# Altium schematic sheet hv_top.SchDoc: AcroIQ HV LED: Top Level
size A4; Author: Yann Ramin; DocumentNumber: 1; Revision: C; SheetNumber: 1; SheetTotal: 4
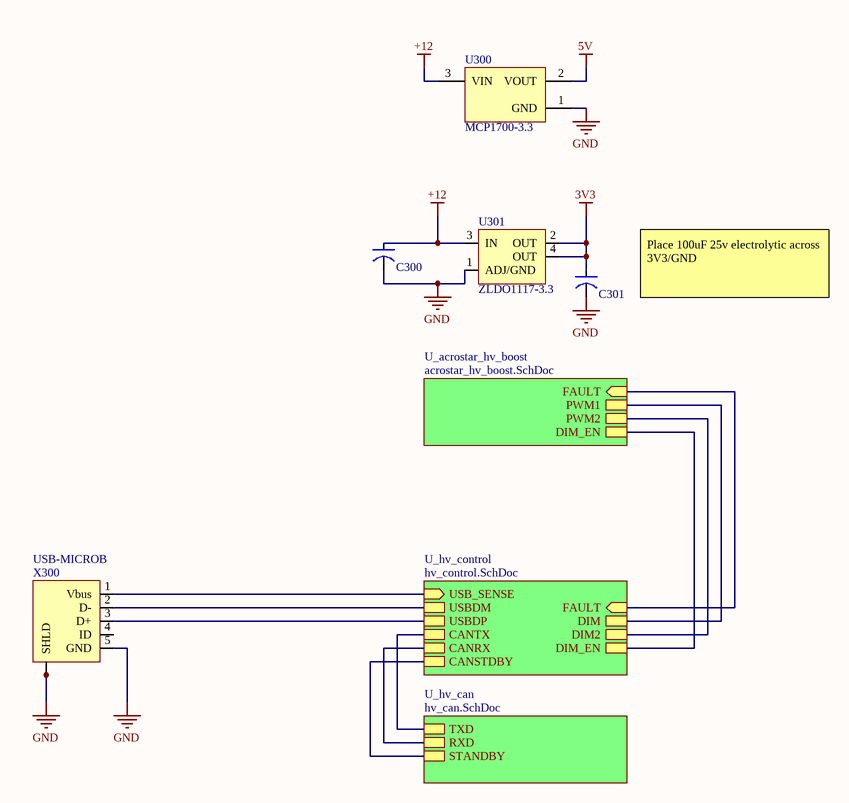
[diagram p0: hv_top.SchDoc]

## Parts
C300  CAP 4.7uF 25V TANT 2312  [CAPMP6032X28M]  (value not drawn)
C301  CAP 4.7uF 25V TANT 2312  [CAPMP6032X28M]  (value not drawn)
U300  MCP1700-3.3  [SOT-23-TT3_N]
U301  ZLDO1117-3.3  [SOT223]
X300  USB-MICROB  [FCI-10118193-0001LF]

## Sub-sheets
U_acrostar_hv_boost = acrostar_hv_boost.SchDoc: DIM_EN, FAULT (in), PWM2, PWM1
U_hv_can = hv_can.SchDoc: TXD, RXD, STANDBY
U_hv_control = hv_control.SchDoc: USB_SENSE (in), USBDM, USBDP, CANTX, CANRX, CANSTDBY, DIM, DIM2, DIM_EN, FAULT (in)

## Nets
3V3: C301.1 U301.2(OUT) U301.4(OUT)
5V: U300.2(VOUT)
+12: C300.1 U300.3(VIN) U301.3(IN)
GND: C300.2 C301.2 U300.1(GND) U301.1(ADJ/GND) X300.5(GND) X300.G1 X300.G2 X300.G3 X300.G4 X300.T1(SHLD) X300.T2
NetX300_1: X300.1(Vbus) ; sheet U_hv_control/USB_SENSE
NetX300_2: X300.2(D-) ; sheet U_hv_control/USBDM
NetX300_3: X300.3(D+) ; sheet U_hv_control/USBDP
(unnamed): sheet U_hv_control/CANTX, sheet U_hv_can/TXD
(unnamed): sheet U_hv_control/CANRX, sheet U_hv_can/RXD
(unnamed): sheet U_hv_control/CANSTDBY, sheet U_hv_can/STANDBY
(unnamed): sheet U_hv_control/DIM, sheet U_acrostar_hv_boost/PWM1
(unnamed): sheet U_hv_control/DIM2, sheet U_acrostar_hv_boost/PWM2
(unnamed): sheet U_hv_control/DIM_EN, sheet U_acrostar_hv_boost/DIM_EN
(unnamed): sheet U_hv_control/FAULT, sheet U_acrostar_hv_boost/FAULT

Not connected (* = marked no-connect by the designer): X300 4(ID)

## Notes on the sheet
- Place 100uF 25v electrolytic across 3V3/GND
- Title
- Size:
- Date:
- A4
- Number:
- Time:
- Revision:
- Sheet
- of
- github.com/blueacro
- blueacro.com
- CERN OHL v1.2
- Made available under the
- File:
- © 2021 StackFoundry LLC. All Rights Reserved.

## Library data of the parts
C300 C301 = CMP-001-00089-1: CAPACITOR TANT, 4.7UF, 25V, 10%, REEL; ESR (Equivalent Series Resistance): 2.4R; Polarity: Polar; Leakage Current: 1.2uA; Dielectric Material: Tantalum; Q Factor: 6; Dissipation Factor: 6%; Case Code (Imperial): 2312; Height - Seated (Max): 0.11inch; Features: General Purpose; Capacitance: 4.7uF; Voltage: 25V; Termination: SMD/SMT; Tolerance: 10%; Number of Pins: 2; REACH SVHC: No SVHC; Mount: Surface Mount,PCB; Max Operating Temperature: 125°C; Lead Free: Lead Free; Voltage Rating: 25V; Packaging: Tape and Reel; Case/Package: Molded; Case Code (Metric): 6032; Height: 2.6mm; Lead Pitch: 2.9mm; Radiation Hardening: No; Voltage Rating (DC): 25V; Package Quantity: 1; Depth: 3.2mm; Length: 6mm; Width: 3.2mm; Min Operating Temperature: -55°C
U300 = CMP-114-0004-2: Pwr Sply Func; Voltage Regulator; LDO; SOT-23; PD 369.6mW; VO 3.3V; Regline +/-0.75%/V; Max Supply Voltage: 6V; Min Input Voltage: 2.3V; Dropout Voltage: 178mV; Number of Outputs: 1; Output Type: Fixed; Nominal Supply Current: 4uA; Input Bias Current: 1.6uA; Polarity: Positive; Max Output Current: 250mA; Accuracy: 2%; Package Quantity: 3000; Number of Pins: 3; Min Output Voltage: 3.3V; Max Output Voltage: 3.3V; REACH SVHC: No SVHC; Mount: Surface Mount; Length: 2.9mm; Nominal Output Voltage: 3.3V; Case/Package: SOT-23; Max Power Dissipation: 369.6mW; Radiation Hardening: No; Packaging: Tape and Reel; Height: 0.95mm; Termination: SMD/SMT; Width: 1.3mm; Max Input Voltage: 6V; Power Dissipation: 369.6mW; Lead Free: Lead Free; Max Operating Temperature: 125°C; Contact Plating: Tin,Matte; Output Current: 250mA; Output Voltage: 3.3V; Min Supply Voltage: 2.3V; Min Operating Temperature: -40°C; Output Voltage Accuracy: 2%; Quiescent Current: 4uA
U301 = CMP-091-0000-1: Design Item ID: ZLDO1117-3.3; Source: vreg.SchLib
X300 = CMP-190-0009-1: Design Item ID: USB-MICROB; Source: con-usb.SCHLIB